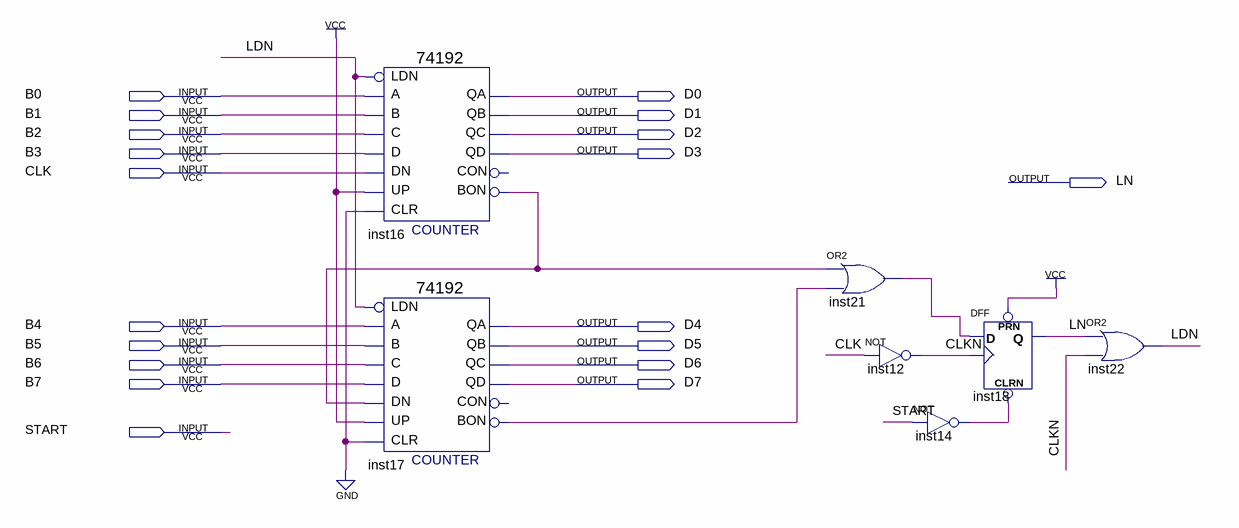
[diagram p0: schematic sheet]
// Quartus schematic Counter_down.bdf as structural Verilog: 7 symbols, 19 pins
module Counter_down (
  input  B0,
  input  B1,
  input  B2,
  input  B3,
  input  CLK,
  input  B4,
  input  B5,
  input  B6,
  input  B7,
  input  START,
  output D0,
  output D1,
  output D2,
  output D3,
  output LN,
  output D4,
  output D5,
  output D6,
  output D7
);

  wire CLKN, inst14_out, inst16_bon, inst17_bon, inst21_out, LDN;

  \74192  inst16 (
    .D(B3), .C(B2), .A(B0), .B(B1), .CLR(1'b0), .UP(1'b1), .DN(CLK), .LDN(LDN), .QB(D1), .BON(inst16_bon),
    .QA(D0), .QC(D2), .QD(D3));  // open: CON
  \74192  inst17 (
    .D(B7), .C(B6), .A(B4), .B(B5), .CLR(1'b0), .UP(1'b1), .DN(inst16_bon), .LDN(LDN), .QB(D5),
    .BON(inst17_bon), .QA(D4), .QC(D6), .QD(D7));  // open: CON
  or inst21 (inst21_out, inst16_bon, inst17_bon);
  not inst12 (CLKN, CLK);
  not inst14 (inst14_out, START);
  DFF inst18 (.CLRN(inst14_out), .CLK(CLKN), .D(inst21_out), .PRN(1'b1), .Q(LN));
  or inst22 (LDN, LN, CLKN);
endmodule
